# Altium project Booster_Board.PrjPcb
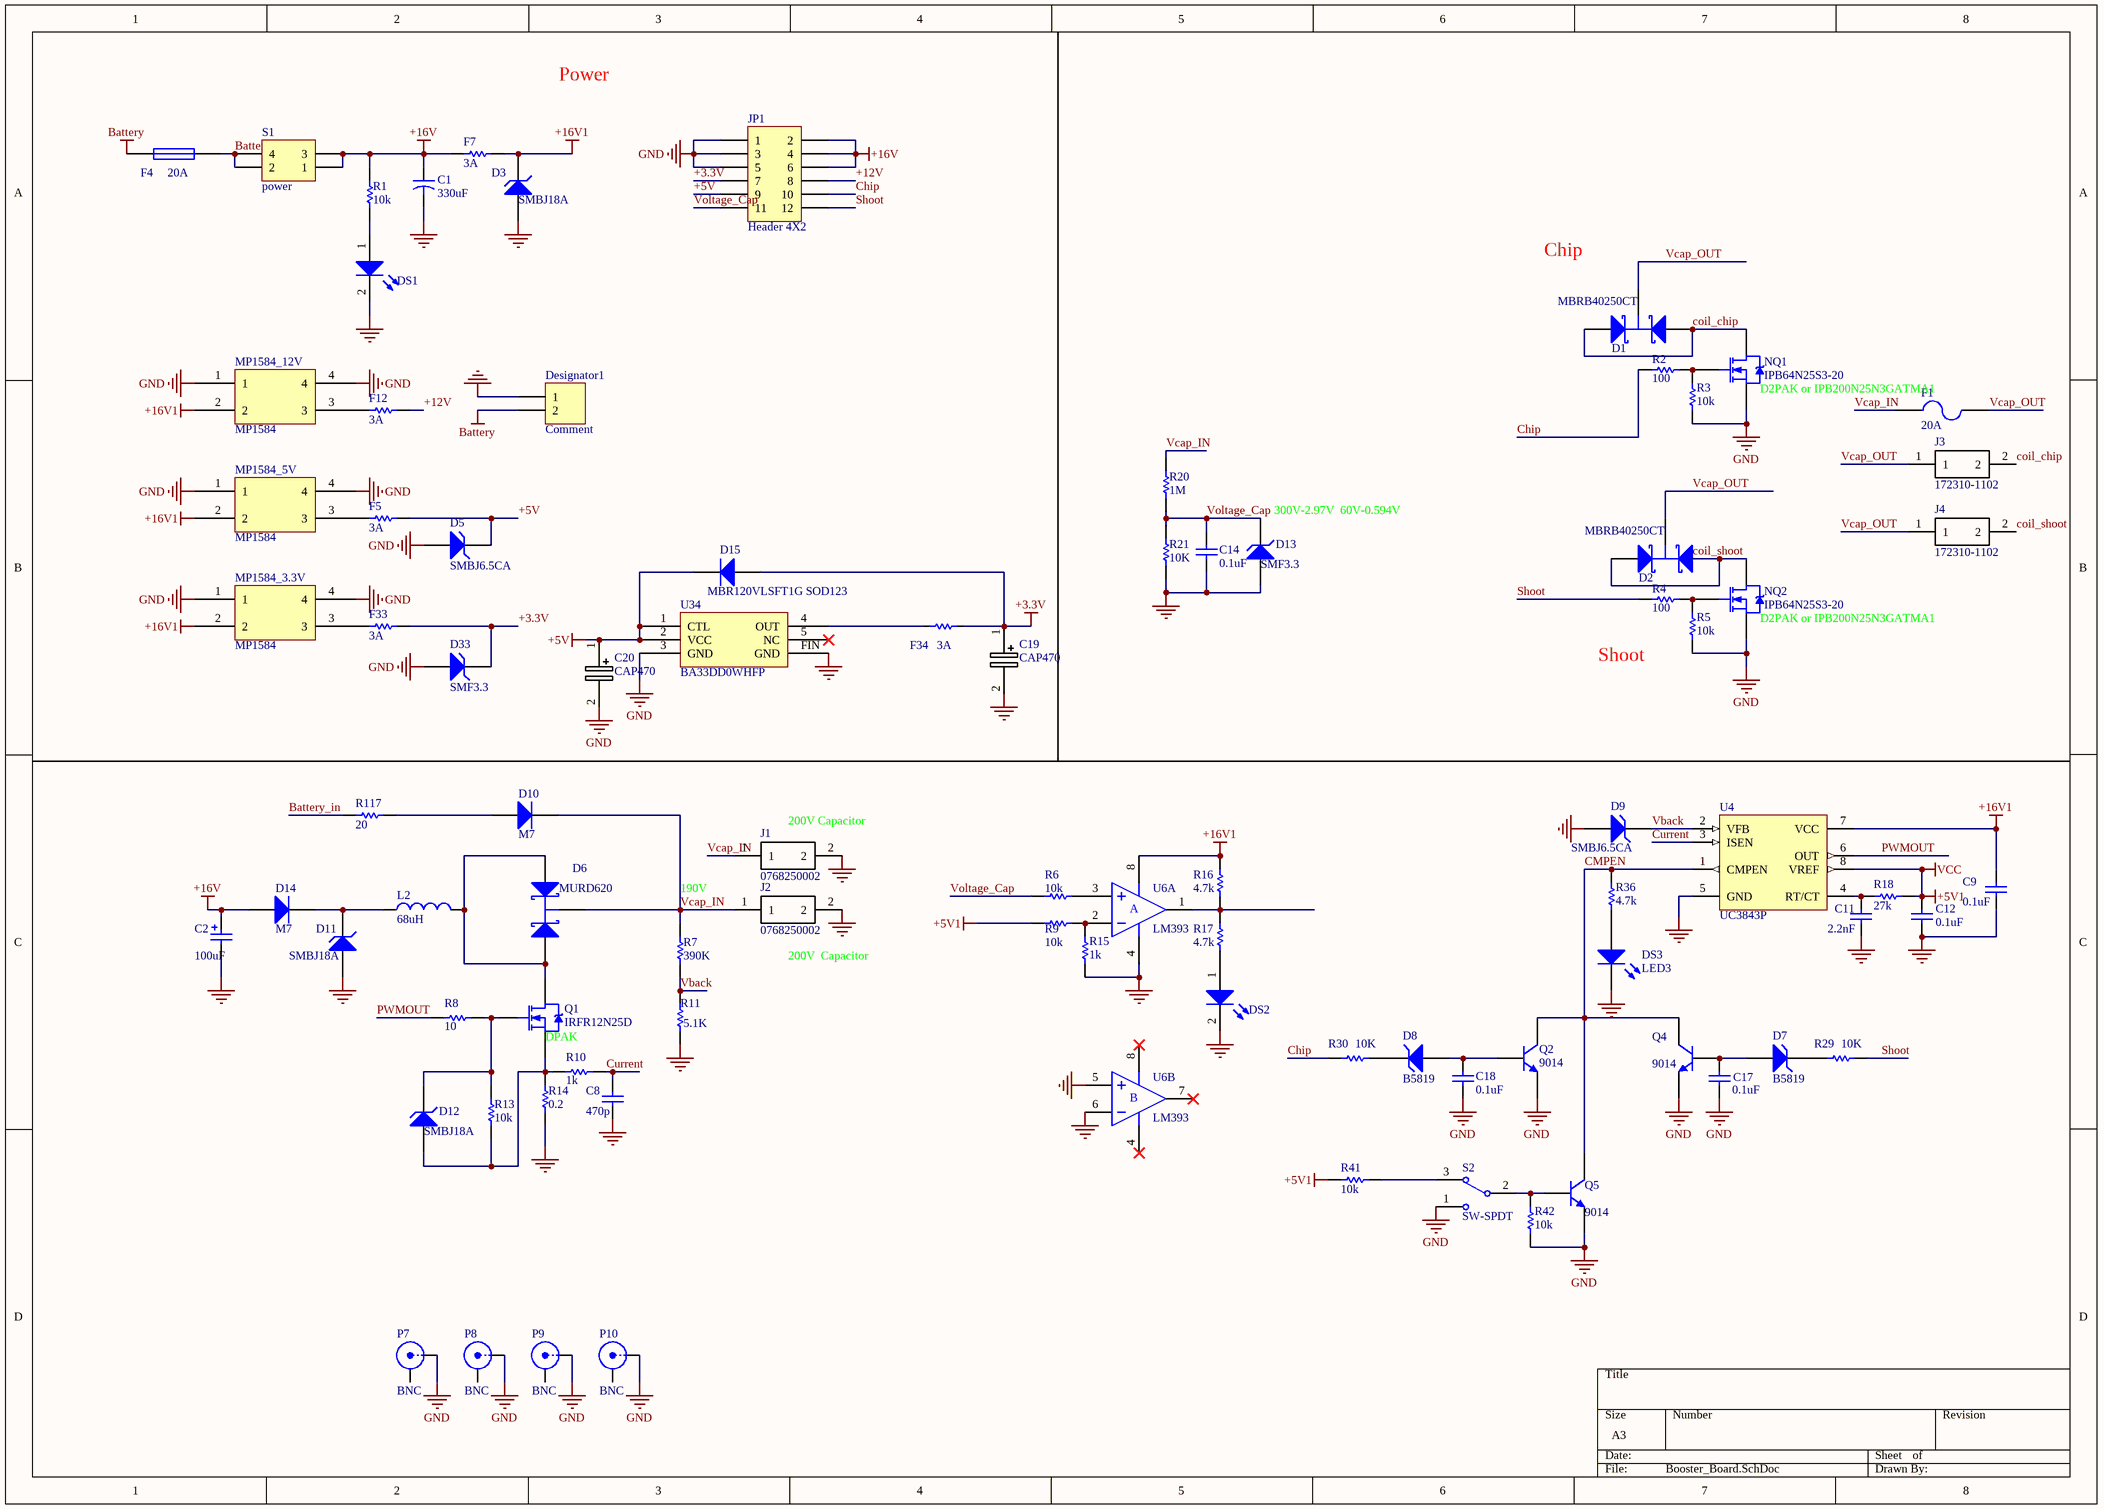
[diagram p0: Booster_Board.SchDoc]
1 sheet, 86 parts. Net scope: global (net labels, ports and power ports of the same name join across sheets).
Board file: Booster_Board.PcbDoc

## Sheet Booster_Board.SchDoc
size A3

### Parts
C1  330uF  [470uF]
C2  100uf  [100uF]
C8  470p  [0805C]
C9  0.1uF  [0805C]
C11  2.2nf  [0805C]
C12  0.1uF  [0805C]
C14  0.1uF  [0805C]
C17  0.1uF  [0805c]
C18  0.1uF  [0805c]
C19  CAP470  [CAPPM7360X200N]
C20  CAP470  [CAPPM7360X200N]
D1  MBRB40250CT  [D2PAK]
D2  MBRB40250CT  [D2PAK]
D3  SMBJ18A  [SMBJ6.5]
D5  SMBJ6.5CA  [SMBJ6.5]
D6  MURD620  [DPAK]
D7  B5819  [sod-123]
D8  B5819  [sod-123]
D9  SMBJ6.5CA  [SMBJ6.5]
D10  M7  [SMA]
D11  SMBJ18A  [SMBJ6.5]
D12  SMBJ18A  [SMBJ6.5]
D13  SMF3.3  [SMF33]
D14  M7  [SMA]
D15  MBR120VLSFT1G SOD123  [sod123]
D33  SMF3.3  [SMF33]
Designator1  Comment  [XT60PW]
DS1  LED2  [0805A]  (value not drawn)
DS2  LED2  [0805A]  (value not drawn)
DS3  LED3  [0805A]
F1  20A  [20A]
F4  20A  [20A]
F5  3A  [2512r]
F7  3A  [2512r]
F12  3A  [2512r]
F33  3A  [2512r]
F34  3A  [2512r]
J1  0768250002  [0768250002_version2]
J2  0768250002  [0768250002_version2]
J3  172310-1102  [172310-1102_VERSION2]
J4  172310-1102  [172310-1102_VERSION2]
JP1  Header 4X2  [2*6_2.5mm]
L2  68uH  [INDPM120120X1020N]
MP1584_3.3V  MP1584  [1584]
MP1584_5V  MP1584  [1584]
MP1584_12V  MP1584  [1584]
NQ1  IPB64N25S3-20  [D2PAK]
NQ2  IPB64N25S3-20  [D2PAK]
P7  BNC  [hole]
P8  BNC  [hole]
P9  BNC  [hole]
P10  BNC  [hole]
Q1  IRFR12N25D  [DPAK]
Q2  9014  [SOT23A]
Q4  9014  [sot23a]
Q5  9014  [SOT23a]
R1  10k  [0805R]
R2  100  [0805r]
R3  10k  [0805R]
R4  100  [0805r]
R5  10k  [0805R]
R6  10k  [0805R]
R7  390K  [0805R]
R8  10  [0805R]
R9  10k  [0805R]
R10  1k  [0805R]
R11  value 5.1K  [0805R]  (hidden comment: 3.3K)
R13  10k  [0805R]
R14  0.2  [0.2_4527R]
R15  1k  [0805R]
R16  4.7k  [0805R]
R17  4.7k  [0805R]
R18  27k  [0805R]
R20  1m  [0805R]
R21  10k  [0805R]
R29  10k  [0805r]
R30  10k  [0805r]
R36  4.7k  [0805r]
R41  10k  [0805r]
R42  10k  [0805r]
R117  20  [20_2512r]
S1  power  [Rocker_Switch]
S2  SW-SPDT  [SMALL_switch]
U4  UC3843P  [SO-G8]
U6  LM393  [LM393_SO-G8]  (parts A,B of 2)
U34  BA33DD0WHFP  [HRP5_16TO5]

### Nets
+3.3V: C19.1(+) D15.1(A) D33.2(K) F33.1 F34.2 JP1.7
+5V: C20.1(+) D5.2(K) D15.2(K) F5.1 JP1.9 U34.1(CTL) U34.2(VCC)
+5V1: C12.1 R9.2 R18.2 R41.2 U4.8(VREF)  [also labelled VCC]
+16V: C1.1 C2.1 D14.1(A) F7.2 JP1.2 JP1.4 JP1.6 R1.2 S1.1 S1.3
+16V1: C9.2 D3.2(K) F7.1 MP1584_3.3V.2 MP1584_5V.2 MP1584_12V.2 R16.2 U4.7(VCC) U6.8(V+)
Battery: Designator1.2 F4.2
GND: C1.2 C2.2 C8.2 C9.1 C11.2 C12.2 C14.1 C17.1 C18.1 C19.2(-) C20.2(-) D3.1(A) D5.1(A) D9.1(A) D11.1(A) D13.1(A) D33.1(A) Designator1.1 DS1.2(K) DS2.2(K) DS3.2(K) J1.2 J2.2 JP1.1 JP1.3 JP1.5 MP1584_3.3V.1 MP1584_3.3V.4 MP1584_5V.1 MP1584_5V.4 MP1584_12V.1 MP1584_12V.4 NQ1.3(S) NQ2.3(S) P7.1(X) P8.1(X) P9.1(X) P10.1(X) Q2.2(E) Q4.2(E) Q5.2(E) R3.1 R5.1 R11.1 R14.1 R15.2 R21.1 R42.2 S2.1 U4.5(GND) U6.4(V-) U6.5(IN+) U6.6(IN-) U34.3(GND) U34.FIN(GND)
+12V: F12.1 JP1.8
Battery_in: F4.1 R117.2 S1.2 S1.4
Chip: JP1.10 R2.1 R30.1
CMPEN: Q2.3(C) Q4.3(C) Q5.3(C) R36.2 U4.1(CMPEN)
coil_chip: D1.1(A1) D1.3(A2) J3.2 NQ1.2(D)
coil_shoot: D2.1(A1) D2.3(A2) J4.2 NQ2.2(D)
Current: C8.1 R10.2 U4.3(ISEN)
PWMOUT: R8.1 U4.6(OUT)
Shoot: JP1.12 R4.1 R29.2
Vback: D9.2(K) R7.1 R11.2 U4.2(VFB)
Vcap_IN: D6.2(K) D10.2(K) F1.1 J1.1 J2.1 R7.2 R20.2
Vcap_OUT: D1.2(K) D2.2(K) F1.2 J3.1 J4.1
Voltage_Cap: C14.2 D13.2(K) JP1.11 R6.2 R20.1 R21.2
NetC11_1: C11.1 R18.1 U4.4(RT/CT)
NetC17_2: C17.2 D7.1(A) Q4.1(B)
NetC18_2: C18.2 D8.1(A) Q2.1(B)
NetD6_1: D6.1(A1) D6.3(A2) L2.2 Q1.2(D)
NetD7_2: D7.2(K) R29.1
NetD8_2: D8.2(K) R30.2
NetD10_1: D10.1(A) R117.1
NetD11_2: D11.2(K) D14.2(K) L2.1
NetD12_1: D12.1(A) Q1.3(S) R10.1 R13.1 R14.2
NetD12_2: D12.2(K) Q1.1(G) R8.2 R13.2
NetDS1_1: DS1.1(A) R1.1
NetDS2_1: DS2.1(A) R17.1
NetDS3_1: DS3.1(A) R36.1
NetF5_2: F5.2 MP1584_5V.3
NetF12_2: F12.2 MP1584_12V.3
NetF33_2: F33.2 MP1584_3.3V.3
NetF34_1: F34.1 U34.4(OUT)
NetNQ1_1: NQ1.1(G) R2.2 R3.2
NetNQ2_1: NQ2.1(G) R4.2 R5.2
NetQ5_1: Q5.1(B) R42.1 S2.2
NetR6_1: R6.1 U6.3(IN+)
NetR9_1: R9.1 R15.1 U6.2(IN-)
NetR16_1: R16.1 R17.2 U6.1(OUT)
NetR41_1: R41.1 S2.3

Not connected (* = marked no-connect by the designer): P7 2(Y); P8 2(Y); P9 2(Y); P10 2(Y); U6 7(OUT)*; U34 5(NC)*

### Notes on the sheet
- Power
- Chip
- D2PAK or IPB200N25N3GATMA1
- (near D13) 300V-2.97V  60V-0.594V
- (near NQ2) D2PAK or IPB200N25N3GATMA1
- Shoot
- (near J1) 200V Capacitor
- 190V
- (near J2) 200V  Capacitor
- (near Q1) DPAK
- (in symbol LM393, part A) A
- (in symbol LM393, part B) B

### Library data of the parts
C1 = Cap2: Capacitor; Published: 23-Sep-2002; Publisher: Altium Limited
C2 = Cap Pol1: Polarized Capacitor (Radial); Manufacturer: Generic Components; Class: Passive; Published: 08/06/2000; Publisher: Altium Hobart Technology Centre; SubClass: Capacitor; Value: 100uF
C8 C11 C12 = Cap: Capacitor; Manufacturer: Generic Components; Class: Passive; Published: 08/06/2000; Publisher: Altium Hobart Technology Centre; SubClass: Capacitor
  C8: Value: 470p
  C11: Value: 2.2nF
  C12: Value: 0.1uF
C9 C14 C17 C18 = Cap: Capacitor; Published: 8-Jun-2000; LatestRevisionDate: 17-Jul-2002; LatestRevisionNote: Re-released for DXP Platform.; Publisher: Altium Limited
C19 C20 = T523H477M016APE0707280: 470uF电容贴片; Manufacturer_Name: Kemet; Datasheet Link: https://api.kemet.com/component-edge/download/datasheet/T523H477M016APE0707280.pdf; Height: 2mm; Manufacturer_Part_Number: T523H477M016APE0707280; Mouser Part Number: 80-T523H477M16P070LR; Mouser Price/Stock: https://www.mouser.com/Search/Refine.aspx?Keyword=80-T523H477M16P070LR
D1 D2 D6 = MBRB1545CT: Schottky Rectifier; Manufacturer: International Rectifier; Class: Discrete; SubClass: Rectifier - Schottky; Note: Terminal 2 is the TAB and is electrically connected to the cathode; Published: 8/06/2000; Publisher: Altium Hobart Technology Centre
D3 D5 D7-D9 D11-D13 D33 = D Zener: Zener Diode; Published: 8-Jun-2000; LatestRevisionDate: 17-Jul-2002; LatestRevisionNote: Re-released for DXP Platform.; PackageReference: DIODE-0.7; Publisher: Altium Limited
D10 D14 D15 = Diode: Default Diode; Manufacturer: Generic Components; Class: Discrete; SubClass: Diode - Switching; Published: 08/06/2000; Publisher: Altium Hobart Technology Centre
Designator1 = Header 2: Header, 2-Pin; LatestRevisionDate: 17-Jul-2002; LatestRevisionNote: Re-released for DXP Platform.; Publisher: Altium Limited
DS1 DS2 = LED2: Typical RED, GREEN, YELLOW, AMBER GaAs LED; Manufacturer: Generic Components; Class: Optoelectronic; Published: 08/06/2000; Publisher: Altium Hobart Technology Centre; SubClass: LED
  DS1: COLOUR: GREEN
DS3 = LED2: Typical RED, GREEN, YELLOW, AMBER GaAs LED; Published: 8-Jun-2000; LatestRevisionDate: 17-Jul-2002; LatestRevisionNote: Re-released for DXP Platform.; PackageDocument: Feb-2002; PackageReference: 3.2X1.6X1.1; Publisher: Altium Limited; COLOUR: GREEN
F1 = Fuse 2: Published: 8-Jun-2000; LatestRevisionDate: 17-Jul-2002; LatestRevisionNote: Re-released for DXP Platform.; Publisher: Altium Limited
F4 = Fuse 1: Fuse; Published: 8-Jun-2000; LatestRevisionDate: 17-Jul-2002; LatestRevisionNote: Re-released for DXP Platform.; PackageReference: PIN-W2/E2.8; Publisher: Altium Limited
F5 F7 F12 F33 R1 R6-R11 R13-R18 R20 R21 R29 R30 R36 R41 R42 R117 = Res1: Resistor; Manufacturer: Generic Components; Class: Passive; Published: 08/06/2000; Publisher: Altium Hobart Technology Centre; SubClass: Resistor
  F5 F7 F12 F33: Value: 3A
  R1 R6 R9 R13 R41 R42: Value: 10k
  R7: Value: 390K
  R8: Value: 10
  R10 R15: Value: 1k
  R14: Value: 0.2
  R16 R17 R36: Value: 4.7k
  R18: Value: 27k
  R20: Value: 1M
  R21 R29 R30: Value: 10K
  R117: Value: 20
F34 = Res1: Resistor; Published: 8-Jun-2000; LatestRevisionDate: 17-Jul-2002; LatestRevisionNote: Re-released for DXP Platform.; Publisher: Altium Limited
J1 J2 = 0768250002: Connector; Manufacturer_Name: Molex; Datasheet Link: https://www.molex.com/pdm_docs/sd/768250002_sd.pdf; Height: 16mm; Manufacturer_Part_Number: 0768250002; Mouser Part Number: N/A; Mouser Price/Stock: https://www.mouser.com/Search/Refine.aspx?Keyword=N%2FA
J3 J4 = 172310-1102: Connector; Manufacturer_Name: Molex; Allied_Number: 70617676; Datasheet Link: http://www.farnell.com/cad/1986622.pdf; Manufacturer_Part_Number: 172310-1102; Mouser Part Number: 538-172310-1102; Mouser Price/Stock: https://www.mouser.com/Search/Refine.aspx?Keyword=538-172310-1102; RS Part Number: 8951880; RS Price/Stock: http://uk.rs-online.com/web/p/products/8951880; Allied Price/Stock: http://www.alliedelec.com/molex-incorporated-172310-1102/70617676/
JP1 = Header 6X2: Header, 4-Pin, Dual row; LatestRevisionDate: 17-Jul-2002; LatestRevisionNote: Re-released for DXP Platform.; Publisher: Altium Limited
L2 = Inductor: Code_IEC: 1005; Published: 8-Jun-2000; LatestRevisionDate: 17-Jul-2002; LatestRevisionNote: Re-released for DXP Platform.; PackageReference: 0402-A; Publisher: Altium Limited; Code_JEITA: 0402
NQ1 NQ2 = IRFP460: HEXFET Power MOSFET; Manufacturer: International Rectifier; Class: Discrete; SubClass: MOSFET - Power; Note: Pin 2 is electrically connected to the Heatsink (4).; Published: 8/06/2000; Publisher: Altium Hobart Technology Centre
P7-P10 = BNC: BNC Elbow Connector; LatestRevisionDate: 17-Jul-2002; LatestRevisionNote: Re-released for DXP Platform.; Publisher: Altium Limited
Q1 = NMOS-2: N-Channel Power MOSFET; Note: Pin 2 is electrically connected to pin 4.; Published: 8-Jun-2000; LatestRevisionDate: 17-Jul-2002; LatestRevisionNote: Re-released for DXP Platform.; DatasheetDocument: PD-9.814; PackageReference: TO-220AB; Publisher: Altium Limited; Code_JEDEC: TO-220-AB
Q2 Q4 Q5 = BC817-40: NPN General Purpose Amplifier; Manufacturer: Fairchild Semiconductor; Revised: 11-July-2000: SIM Model Added.; Class: Discrete; SubClass: BJT - Low Power; Published: 8/06/2000; Publisher: Altium Hobart Technology Centre
R2-R5 = Res Semi: Semiconductor Resistor; Manufacturer: Generic Components; Class: Passive; Published: 08/06/2000; Publisher: Altium Hobart Technology Centre; SubClass: Resistor
  R2 R4: Value: 100
  R3 R5: Value: 10K
S1 = Header 2X2: Header, 2-Pin, Dual row; LatestRevisionDate: 17-Jul-2002; LatestRevisionNote: Re-released for DXP Platform.; Publisher: Altium Limited
S2 = SW-SPDT: SPDT Subminiature Toggle Switch, Right Angle Mounting, Vertical Actuation; Published: 24-Mar-1999; LatestRevisionDate: 17-Dec-2003; LatestRevisionNote: Schematic revised, PCB Footprint replaced.; DatasheetDocument: 05-Dec-2000; PackageReference: TL36WW15050; Publisher: Altium Limited; ComponentLink1Description: Manufacturer Link; ComponentLink1URL: http://www.apem.com
U4 = UC3843P: Current-Mode PWM Controller; Published: 15-Apr-2002; LatestRevisionDate: 6-Jun-2005; LatestRevisionNote: Stylized 3D Model Added.; DatasheetDocument: Dec-1999; PackageDocument: Jun-1999; PackageReference: P008; Publisher: Altium Limited; Code_JEDEC: MO-001-AN; ComponentLink1Description: Manufacturer Link; ComponentLink1URL: http://www.ti.com/
U34 = HRP5-16TO5